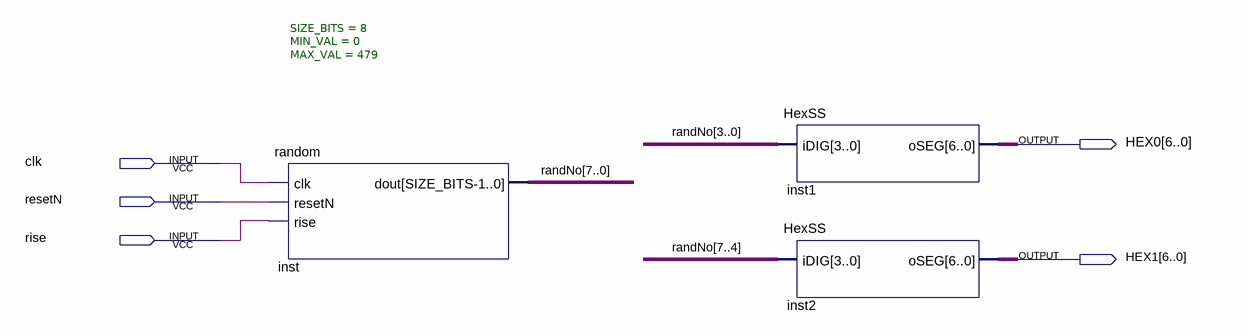
[diagram p0: schematic sheet]
// Quartus schematic TOP_RANDOM.bdf as structural Verilog: 3 symbols, 5 pins
module TOP_RANDOM (
  input  clk,
  input  resetN,
  input  rise,
  output [6:0] HEX0,
  output [6:0] HEX1
);

  wire [7:0] randNo;

  random #(.SIZE_BITS(8), .MIN_VAL(0), .MAX_VAL(479)) inst (.clk(clk), .resetN(resetN), .rise(rise), .dout(randNo));
  HexSS inst1 (.iDIG(randNo[3:0]), .oSEG(HEX0));
  HexSS inst2 (.iDIG(randNo[7:4]), .oSEG(HEX1));
endmodule
